# EAGLE design MO-v2-2_MOD-Actuators (EAGLE 8.4.3)
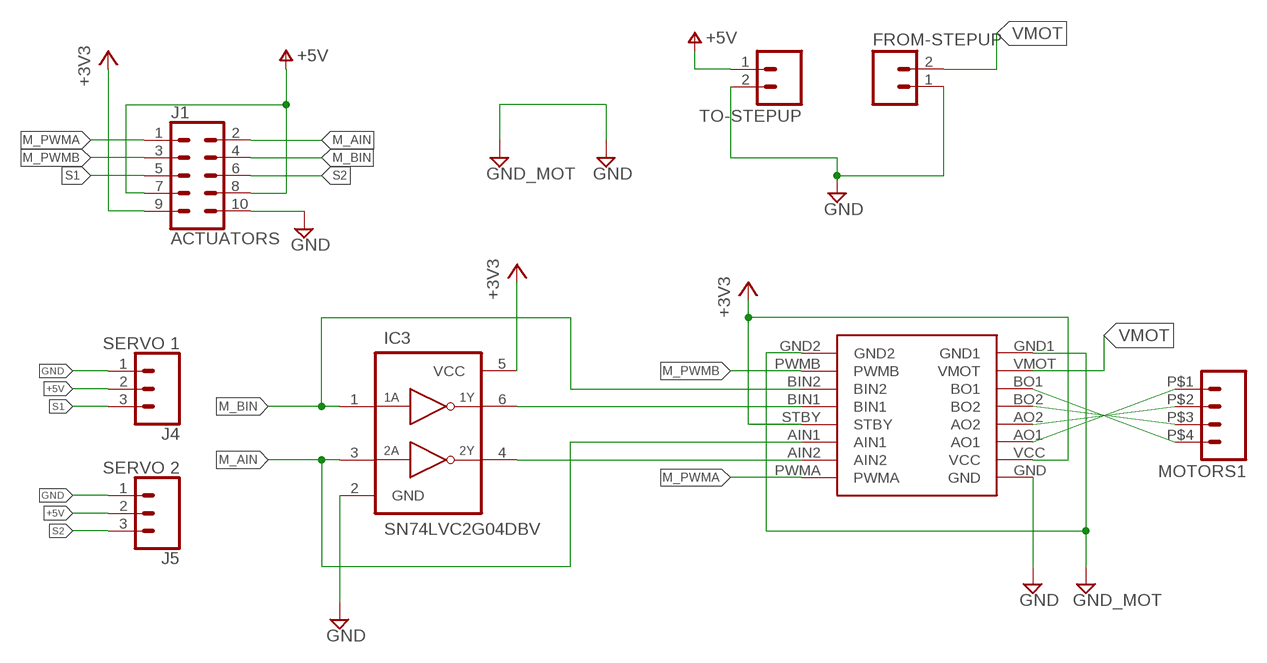
[diagram p0: schematic, sheet 1]

## Parts
FROM-STEPUP  M02LOCK  [1X02_LOCK]
IC3  SN74LVC2G04DBV  [SOT23-6]
J1  ACTUATORS  CONN_05X2SHD_LOCK  [2X5-SHROUDED_LOCK]
J4  SERVO 1  CONN_03LOCK  [1X03_LOCK@1]
J5  SERVO 2  CONN_03LOCK  [1X03_LOCK@1]
MOTORS1  M04  [SPRINGTERMINAL-2.54MM-4]
TO-STEPUP  M02LOCK  [1X02_LOCK]
U$7  POLOLU_TB6612FNG  [POLOLU_TB6612FNG]

## Nets
+3V3: IC3.5(VCC) J1.9 U$7.STBY U$7.VCC
+5V [Power]: J1.7 J1.8 J4.2 J5.2 TO-STEPUP.1 ; supply symbol labelled V+
GND [Power]: FROM-STEPUP.1 IC3.2(GND) J1.10 J4.1 J5.1 TO-STEPUP.2 U$7.GND ; supply symbol labelled GND_MOT
GND_MOT [Power]: U$7.GND1 U$7.GND2
M_AIN: IC3.3(2A) J1.2 U$7.AIN1
M_BIN: IC3.1(1A) J1.4 U$7.BIN2
M_PWMA: J1.1 U$7.PWMA
M_PWMB: J1.3 U$7.PWMB
N$1 [Power]: MOTORS1.P$1 U$7.AO1
N$2 [Power]: MOTORS1.P$2 U$7.AO2
N$3 [Power]: MOTORS1.P$3 U$7.BO2
N$4 [Power]: MOTORS1.P$4 U$7.BO1
N$5: IC3.6(1Y) U$7.BIN1
N$6: IC3.4(2Y) U$7.AIN2
S1: J1.5 J4.3
S2: J1.6 J5.3
VMOT [Power]: FROM-STEPUP.2 U$7.VMOT

## Library data of the parts
FROM-STEPUP TO-STEPUP = CMU-ArtFab:M02: Header 2 Standard 2-pin 0.1" header. Use with straight break away headers (SKU : PRT-00116), right angle break away headers (PRT-00553), swiss pins (PRT-00743), machine pins (PRT-00117), and female headers (PRT-00115). Molex polarized connector foot print use with SKU : PRT-08233 with associated crimp pins and housings.
IC3 = 74LV:SN74LVC2G04: DUAL INVERTER GATE
J1 = SparkFun-Connectors:CONN_05X2: Multi connection point. Often used as Generic Header-pin footprint for 0.1 inch spaced/style header connections For AVR SPI programming port, see special device with nice symbol: "AVR_SPI_PROG_5x2.dev" You can populate with any combo of single row headers, but if you'd like an exact match, check these: 2x5 AVR ICSP Male Header <https://www.sparkfun.com/products/778> (PRT-00778) 2x5 Pin Shrouded Header <https://www.sparkfun.com/products/8506> (PRT-08506) On any of the 0.1 inch spaced packages, you can populate with these: Break Away Headers - Straight <https://www.sparkfun.com/products/116> (PRT-00116) Break Away Male Headers - Right Angle <https://www.sparkfun.com/products/553> (PRT-00553) Female Headers <https://www.sparkfun.com/products/115> (PRT-00115) Break Away Headers - Machine Pin <https://www.sparkfun.com/products/117> (PRT-00117) Break Away Female Headers - Swiss Machine Pin <https://www.sparkfun.com/products/743> (PRT-00743) Special note: the shrouded connector mates well with our 5x2 ribbon cables: 2x5 Pin IDC Ribbon Cable <https://www.sparkfun.com/products/8535> (PRT-08535); PROD_ID: CONN-08671; SF_ID: PRT-08506
J4 J5 = SparkFun-Connectors:CONN_03: Multi connection point. Often used as Generic Header-pin footprint for 0.1 inch spaced/style header connections On any of the 0.1 inch spaced packages, you can populate with these: Break Away Headers - Straight <https://www.sparkfun.com/products/116> (PRT-00116) Break Away Male Headers - Right Angle <https://www.sparkfun.com/products/553> (PRT-00553) Female Headers <https://www.sparkfun.com/products/115> (PRT-00115) Break Away Headers - Machine Pin <https://www.sparkfun.com/products/117> (PRT-00117) Break Away Female Headers - Swiss Machine Pin <https://www.sparkfun.com/products/743> (PRT-00743) Stackable Header - 3 Pin (Female, 0.1") <https://www.sparkfun.com/products/13875> (PRT-13875) For SCREWTERMINALS and SPRING TERMINALS visit here: Screw Terimnals on SparkFun.com <https://www.sparkfun.com/search/results?term=Screw+Terminals> (5mm/3.5mm/2.54mm spacing) This device is also useful as a general connection point to wire up your design to another part of your project. Our various solder wires solder well into these plated through hole pads. Hook-Up Wire - Assortment (Stranded, 22 AWG) <https://www.sparkfun.com/products/11375> (PRT-11375) Hook-Up Wire - Assortment (Solid Core, 22 AWG) <https://www.sparkfun.com/products/11367> (PRT-11367) View the entire wire category on our website here <https://www.sparkfun.com/categories/141> Special notes: Molex polarized connector foot print use with SKU : PRT-08232 with associated crimp pins and housings.
MOTORS1 = CMU-ArtFab:M04: Header 4 Standard 4-pin 0.1" header. Use with straight break away headers (SKU : PRT-00116), right angle break away headers (PRT-00553), swiss pins (PRT-00743), machine pins (PRT-00117), and female headers (PRT-00115). Molex polarized connector foot print use with SKU : PRT-08231 with associated crimp pins and housings. 1MM SMD Version SKU: PRT-10208
U$7 = CMU-ArtFab:POLOLU_TB6612FNG

## Net classes
2 Power: width 0.381 mm, clearance 0.279 mm

## Board
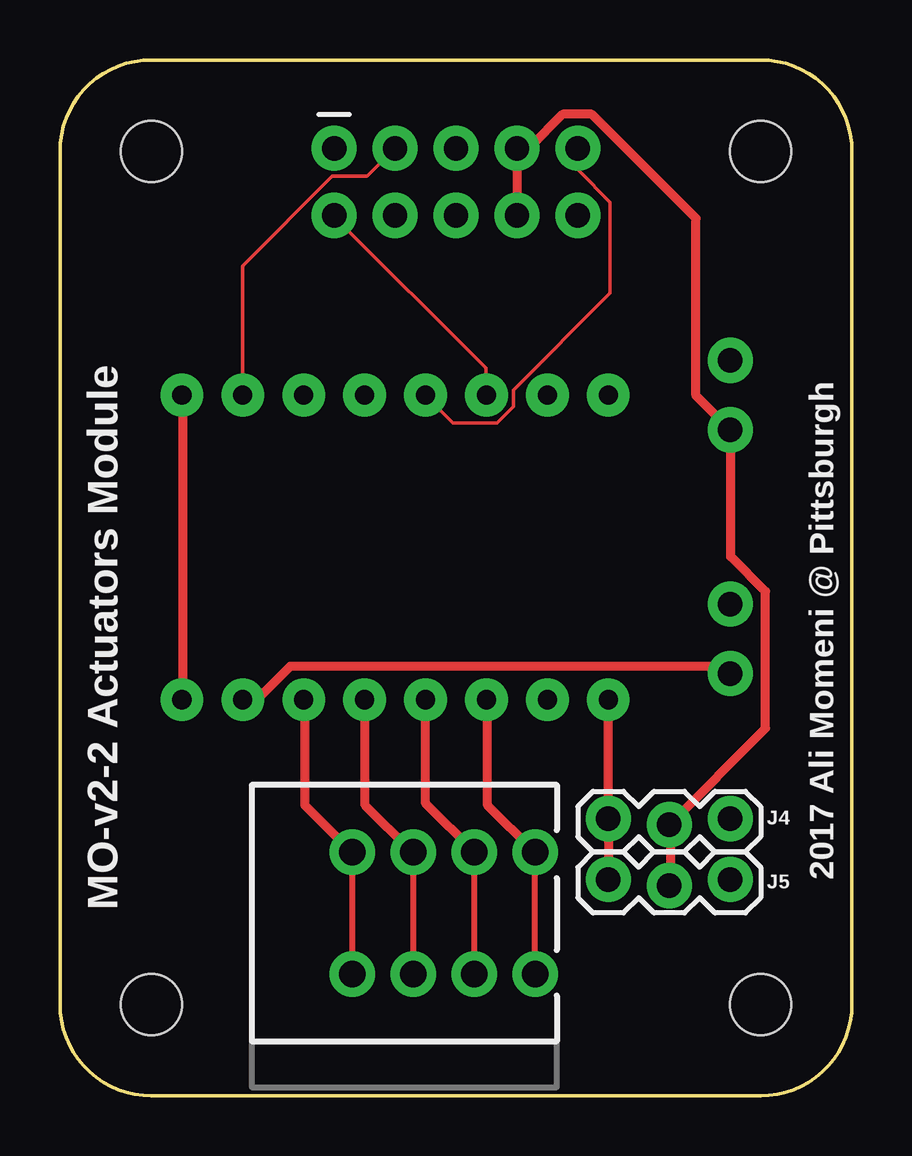
[diagram p1: board, top side]
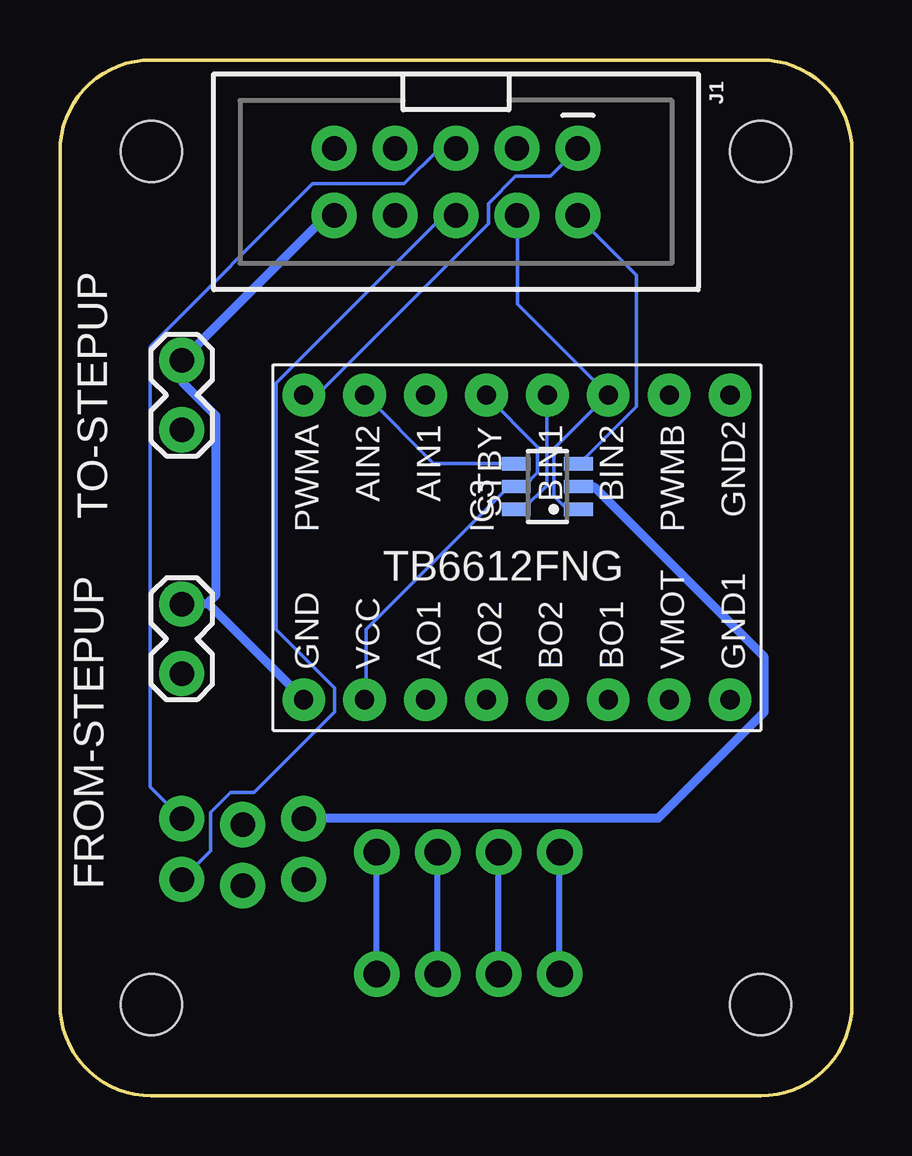
[diagram p2: board, bottom side, seen from below]

Size 33.02 x 43.18 mm. Coordinates in mm from the lower left corner, seen from the top.
Outline: 0,3.81 arc90 3.81,0 29.21,0 arc90 33.02,3.81 33.02,39.37 arc90 29.21,43.18 3.81,43.18 arc90 0,39.37 0,3.81
Copper layers (1*16): Top 0.035mm / dielectric 1.5mm / Bottom 0.035mm
Design rules "SeeedStudio_2layer_DRU_no_angle_20140221": minimum track width 6mil, minimum drill 12mil, track to track 6mil, track to pad 6mil, pad to pad 6mil, via to via 6mil, smd to smd 0mil, copper to edge 10mil, drill to drill 10mil, minimum pad ring 10mil, minimum via ring 6mil, stop-mask expansion 2mil, vias tented up to drill 100mil, thermal gap 10mil
Holes 2.54 mm at 3.81,39.37 29.21,39.37 29.21,3.81 3.81,3.81

### Footprints (pad centres in the part's own frame; a part is rotated, then mirrored left to right if it is on the bottom)
1X02_LOCK = drill 1.016 pad 1.88: 1 -0.178,0; 2 2.718,0
SOT23-6 = smd 0.55 x 1.2: 1 -0.95,-1.3; 2 0,-1.3; 3 0.95,-1.3; 4 0.95,1.3; 5 0,1.3; 6 -0.95,1.3
2X5-SHROUDED_LOCK = drill 1.016 pad 1.88: 1 -1.397,5.08; 2 1.397,5.08; 3 -1.397,2.54; 4 1.397,2.54; 5 -1.397,0; 6 1.397,0; 7 -1.397,-2.54; 8 1.397,-2.54; 9 -1.397,-5.08; 10 1.397,-5.08
1X03_LOCK@1 = drill 1.016 pad 1.88: 1 0,0.127; 2 2.54,-0.127; 3 5.08,0.127
SPRINGTERMINAL-2.54MM-4 = drill 1.1 pad 1.9: 1 7.62,-2.54; 2 5.08,-2.54; 3 2.54,-2.54; 4 0,-2.54; P$1 7.62,2.54; P$2 5.08,2.54; P$3 2.54,2.54; P$4 0,2.54
POLOLU_TB6612FNG = drill 0.8 pad 1.778: AIN1 5.08,3.81; AIN2 5.08,6.35; AO1 -7.62,3.81; AO2 -7.62,1.27; BIN1 5.08,-1.27; BIN2 5.08,-3.81; BO1 -7.62,-3.81; BO2 -7.62,-1.27; GND -7.62,8.89; GND1 -7.62,-8.89; GND2 5.08,-8.89; PWMA 5.08,8.89; PWMB 5.08,-6.35; STBY 5.08,1.27; VCC -7.62,6.35; VMOT -7.62,-6.35

### Placement (x,y rotation side)
FROM-STEPUP  27.94,20.32 270 bottom
IC3  12.7,25.4 90 bottom
J1  16.51,38.1 270 bottom
J4  22.86,11.43 0 top
J5  22.86,8.89 0 top
MOTORS1  12.19,7.62 0 top
TO-STEPUP  27.94,27.94 90 bottom
U$7  13.97,24.13 90 bottom

### Tracks (layer width: path | path; a pad name or v marks a point on that pad's centre or on a via)
+3V3
  Top 0.152: J1.9 21.64,39.47 21.64,38.56 22.94,37.26 22.94,33.45 18.9,29.41 18.9,28.73 18.21,28.04 16.38,28.04 15.24,29.18 U$7.STBY
  Bottom 0.152: U$7.STBY 15.24,29.18 13.11,27.05 13.11,25.98 13.64,25.45 13.95,25.45 IC3.5 14.02,25.38 14.33,25.38 20.27,19.43 20.27,16.54 U$7.VCC
+5V
  Top 0.381: J1.8 J1.7 19.2,39.55 19.58,39.55 20.95,40.92 22.17,40.92 26.52,36.58 26.52,29.18 TO-STEPUP.1 27.96,27.74 27.96,22.48 29.41,21.03 29.41,15.32 J4.2 25.45,11.28 25.45,8.76 J5.2
GND
  Top 0.381: U$7.GND J4.1 J5.1
  Bottom 0.381: J1.10 21.64,36.65 21.95,36.65 TO-STEPUP.2 27.89,30.48 27.89,29.72 26.52,28.35 26.52,20.88 26.75,20.65 26.82,20.5 | IC3.2 11.35,25.38 10.74,25.38 3.66,18.29 3.66,16 8.08,11.58 22.86,11.58 J4.1 | 26.82,20.5 FROM-STEPUP.1 | 26.82,20.5 22.86,16.54 U$7.GND
GND_MOT
  Top 0.381: U$7.GND1 5.11,16.54 5.11,29.18 U$7.GND2
M_AIN
  Top 0.152: U$7.AIN1 17.75,29.26 17.75,30.33 11.43,36.65 J1.2
  Bottom 0.152: IC3.3 11.35,26.36 8.99,28.73 8.99,34.21 11.43,36.65 J1.2
M_BIN
  Bottom 0.152: IC3.1 11.43,24.46 11.89,24.46 12.42,24.99 12.42,26.98 10.21,29.18 U$7.BIN2 13.95,32.99 13.95,36.65 J1.4
M_PWMA
  Bottom 0.152: U$7.PWMA 22.86,29.26 22.25,29.26 15.16,36.35 15.16,37.19 14.02,38.33 12.57,38.33 11.43,39.47 J1.1
M_PWMB
  Top 0.152: U$7.PWMB 7.62,34.59 11.35,38.33 12.8,38.33 J1.3
N$1
  Top 0.381: U$7.AO1 17.83,16.46 17.83,12.12 19.74,10.21 MOTORS1.P$1
N$2
  Top 0.381: U$7.AO2 15.24,12.19 MOTORS1.P$2
N$3
  Top 0.381: U$7.BO2 12.72,16.46 12.72,12.12 14.63,10.21 MOTORS1.P$3
N$4
  Top 0.381: U$7.BO1 10.21,16.46 10.21,12.12 12.12,10.21 MOTORS1.P$4
N$5
  Bottom 0.152: IC3.6 13.95,24.46 13.72,24.46 12.72,25.45 12.72,29.18 U$7.BIN1
N$6
  Bottom 0.152: IC3.4 14.02,26.36 17.45,26.36 20.27,29.18 U$7.AIN2
S1
  Bottom 0.152: J4.3 29.26,12.88 29.26,31.24 22.48,38.02 18.67,38.02 17.22,39.47 16.54,39.47 J1.5
S2
  Bottom 0.152: J5.3 26.75,10.21 26.75,11.81 25.91,12.65 24.92,12.65 21.57,16 21.57,16.99 24,19.43 24,29.72 17.07,36.65 16.54,36.65 J1.6
VMOT
  Top 0.381: U$7.VMOT 7.62,16.54 8.23,16.54 9.6,17.91 27.58,17.91 27.89,17.6 FROM-STEPUP.2

### Text on the board
tNames: 2017 Ali Momeni @ Pittsburgh | MO-v2-2 Actuators Module